# EAGLE design Pinguino4550 (EAGLE 7.6.0)
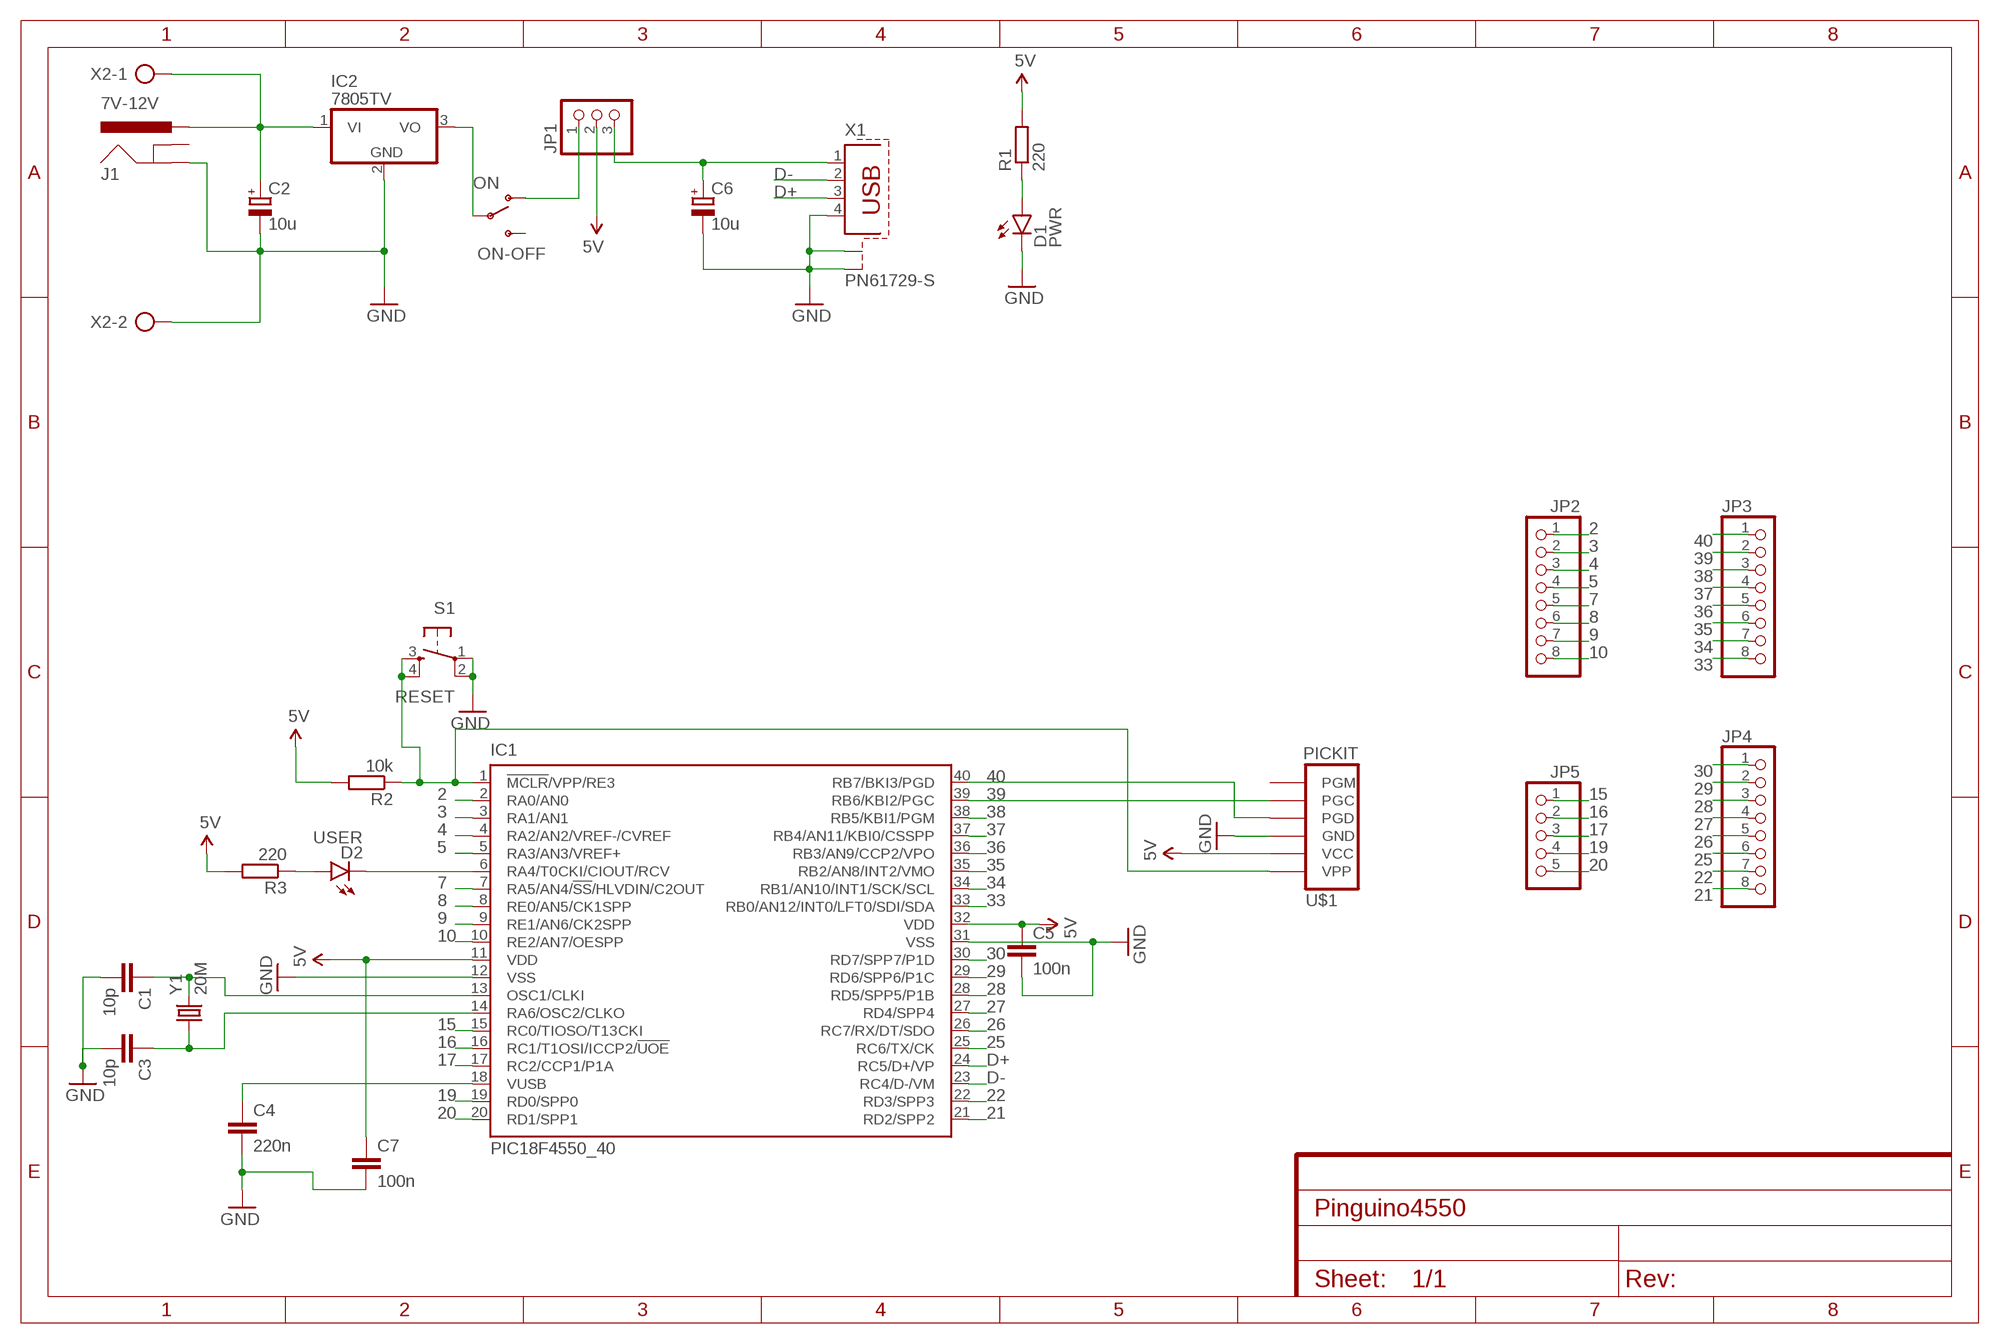
[diagram p0: schematic, sheet 1]

## Parts
C1  10p  C-EU025-030X050  [C025-030X050]
C2  10u  CPOL-EUE2.5-5  [E2,5-5]
C3  10p  C-EU025-030X050  [C025-030X050]
C4  220n  C-EU025-030X050  [C025-030X050]
C5  100n  C-EU025-030X050  [C025-030X050]
C6  10u  CPOL-EUE2.5-5  [E2,5-5]
C7  100n  C-EU025-030X050  [C025-030X050]
D1  PWR  LED5MM  [LED5MM]
D2  USER  LED5MM  [LED5MM]
IC1  PIC18F4550_40  [DIL40]
IC2  7805TV  [TO220V]
J1  7V-12V  POWER_JACKSLT  [POWER_JACK_SLOT]
JP1  PINHD-1X3  [1X03]
JP2  PINHD-1X8  [1X08]
JP3  PINHD-1X8  [1X08]
JP4  PINHD-1X8  [1X08]
JP5  PINHD-1X5  [1X05]
ON-OFF  ON  SWITCH-SPDTPTH  [SWITCH-SPDT]
R1  220  R-EU_0207/7  [0207/7]
R2  10k  R-EU_0207/7  [0207/7]
R3  220  R-EU_0207/7  [0207/7]
S1  RESET  TAC_SWITCHPTH  [TACTILE-PTH]
U$1  PICKIT  PIC-ICSPPOLAR_LOCK  [MOLEX-1X6_LOCK]
X1  PN61729-S  [PN61729-S]
X2  AK500/2  [AK500/2]
Y1  20M  CRYSTALHC49US  [HC49US]

## Nets
2: IC1.2(RA0/AN0) JP2.1
3: IC1.3(RA1/AN1) JP2.2
4: IC1.4(RA2/AN2/VREF-/CVREF) JP2.3
5: IC1.5(RA3/AN3/VREF+) JP2.4
5V: C5.1 C7.1 IC1.11(VDD) IC1.32(VDD) JP1.2 R1.2 R2.2 R3.2 U$1.5(VCC)
7: IC1.7(RA5/AN4/!SS!/HLVDIN/C2OUT) JP2.5
8: IC1.8(RE0/AN5/CK1SPP) JP2.6
9: IC1.9(RE1/AN6/CK2SPP) JP2.7
10: IC1.10(RE2/AN7/OESPP) JP2.8
15: IC1.15(RC0/TIOSO/T13CKI) JP5.1
16: IC1.16(RC1/T1OSI/ICCP2/!UOE) JP5.2
17: IC1.17(RC2/CCP1/P1A) JP5.3
19: IC1.19(RD0/SPP0) JP5.4
20: IC1.20(RD1/SPP1) JP5.5
21: IC1.21(RD2/SPP2) JP4.8
22: IC1.22(RD3/SPP3) JP4.7
25: IC1.25(RC6/TX/CK) JP4.6
26: IC1.26(RC7/RX/DT/SDO) JP4.5
27: IC1.27(RD4/SPP4) JP4.4
28: IC1.28(RD5/SPP5/P1B) JP4.3
29: IC1.29(RD6/SPP6/P1C) JP4.2
30: IC1.30(RD7/SPP7/P1D) JP4.1
33: IC1.33(RB0/AN12/INT0/LFT0/SDI/SDA) JP3.8
34: IC1.34(RB1/AN10/INT1/SCK/SCL) JP3.7
35: IC1.35(RB2/AN8/INT2/VMO) JP3.6
36: IC1.36(RB3/AN9/CCP2/VPO) JP3.5
37: IC1.37(RB4/AN11/KBI0/CSSPP) JP3.4
38: IC1.38(RB5/KBI1/PGM) JP3.3
39: IC1.39(RB6/KBI2/PGC) JP3.2 U$1.2(PGC)
40: IC1.40(RB7/BKI3/PGD) JP3.1 U$1.3(PGD)
D+: IC1.24(RC5/D+/VP) X1.3
D-: IC1.23(RC4/D-/VM) X1.2
GND: C1.2 C2.- C3.2 C4.2 C5.2 C6.- C7.2 D1.K(C) IC1.12(VSS) IC1.31(VSS) IC2.2(GND) J1.GND@2(GND) S1.1 S1.2 U$1.4(GND) X1.4 X1.S1 X1.S2 X2.2
N$1: C2.+ IC2.1(VI) J1.PWR X2.1
N$2: D1.A R1.1
N$3: IC2.3(VO) ON-OFF.2(P)
N$4: JP1.1 ON-OFF.1(O)
N$5: C1.1 IC1.13(OSC1/CLKI) Y1.2
N$6: C6.+ JP1.3 X1.1
N$7: C3.1 IC1.14(RA6/OSC2/CLKO) Y1.1
N$8: IC1.1(!MCLR!/VPP/RE3) R2.1 S1.3 S1.4 U$1.6(VPP)
N$11: D2.K(C) IC1.6(RA4/T0CKI/CIOUT/RCV)
N$12: D2.A R3.1
N$13: C4.1 IC1.18(VUSB)
Unconnected: J1.GND@1(GNDBREAK) ON-OFF.3(S) U$1.1(PGM)

## Library data of the parts
C1 C3-C5 C7 = rcl:C-EU: CAPACITOR, European symbol
C2 C6 = rcl:CPOL-EU: POLARIZED CAPACITOR, European symbol
D1 D2 = SparkFun-LED:LED: LEDs Standard schematic elements and footprints for 5mm, 3mm, 1206, and 0603 sized LEDs. 5mm - Spark Fun Electronics SKU : COM-00529 (and others)
IC1 = microchip:PIC18F4*_40: USB Microcontrollers with nanoWatt Technology High-Performance, Enhanced Flash, 28/40/44-Pin, Source: http://ww1.microchip.com/downloads/en/devicedoc/39632c.pdf; MF: MICROCHIP; MPN: PIC18F4550-I/P; OC_FARNELL: 9321357; OC_NEWARK: 74K8623
IC2 = linear:78*: Positive VOLTAGE REGULATOR Source: http://cache.national.com/ds/LM/LM78L05.pdf http://www.fairchildsemi.com/ds/LM/LM7805.pdf
J1 = SparkFun-Connectors:POWER_JACK: Power Jack This is the standard 5.5mm barrel jack for power. The PTH is the most common, proven, reliable, footprint. The Slot footprint only works if the mill layer is transmitted to the PCB fab house so be warned. Mating wall wart : TOL-00298 (and others); PROD_ID: PRT-00119
JP1 = pinhead:PINHD-1X3: PIN HEADER
JP2-JP4 = pinhead:PINHD-1X8: PIN HEADER
JP5 = pinhead:PINHD-1X5: PIN HEADER
ON-OFF = SparkFun-Electromechanical:SWITCH-SPDT: SPDT Switch Simple slide switch, Spark Fun Electronics SKU : COM-00102 DPDT SMT slide switch, AYZ0202, SWCH-08179; PROD_ID: SWCH-08261
R1-R3 = rcl:R-EU_: RESISTOR, European symbol
S1 = SparkFun-Retired:TAC_SWITCH: Momentary Switch Button commonly used for reset or general input. Spark Fun Electronics SKU : COM-00097 SMT- SWCH-08247
U$1 = SparkFun-Connectors:PIC-ICSP: ISCP Programming connector for UAV, UBW Kit, etc.
X1 = con-berg:PN61729-S: BERG USB connector; OC_FARNELL: unknown; OC_NEWARK: unknown
X2 = con-ptr500:AK500/2: CONNECTOR; OC_FARNELL: unknown; OC_NEWARK: unknown
Y1 = SparkFun-FreqCtrl:CRYSTAL: Various standard crystals. Proven footprints.

## Board
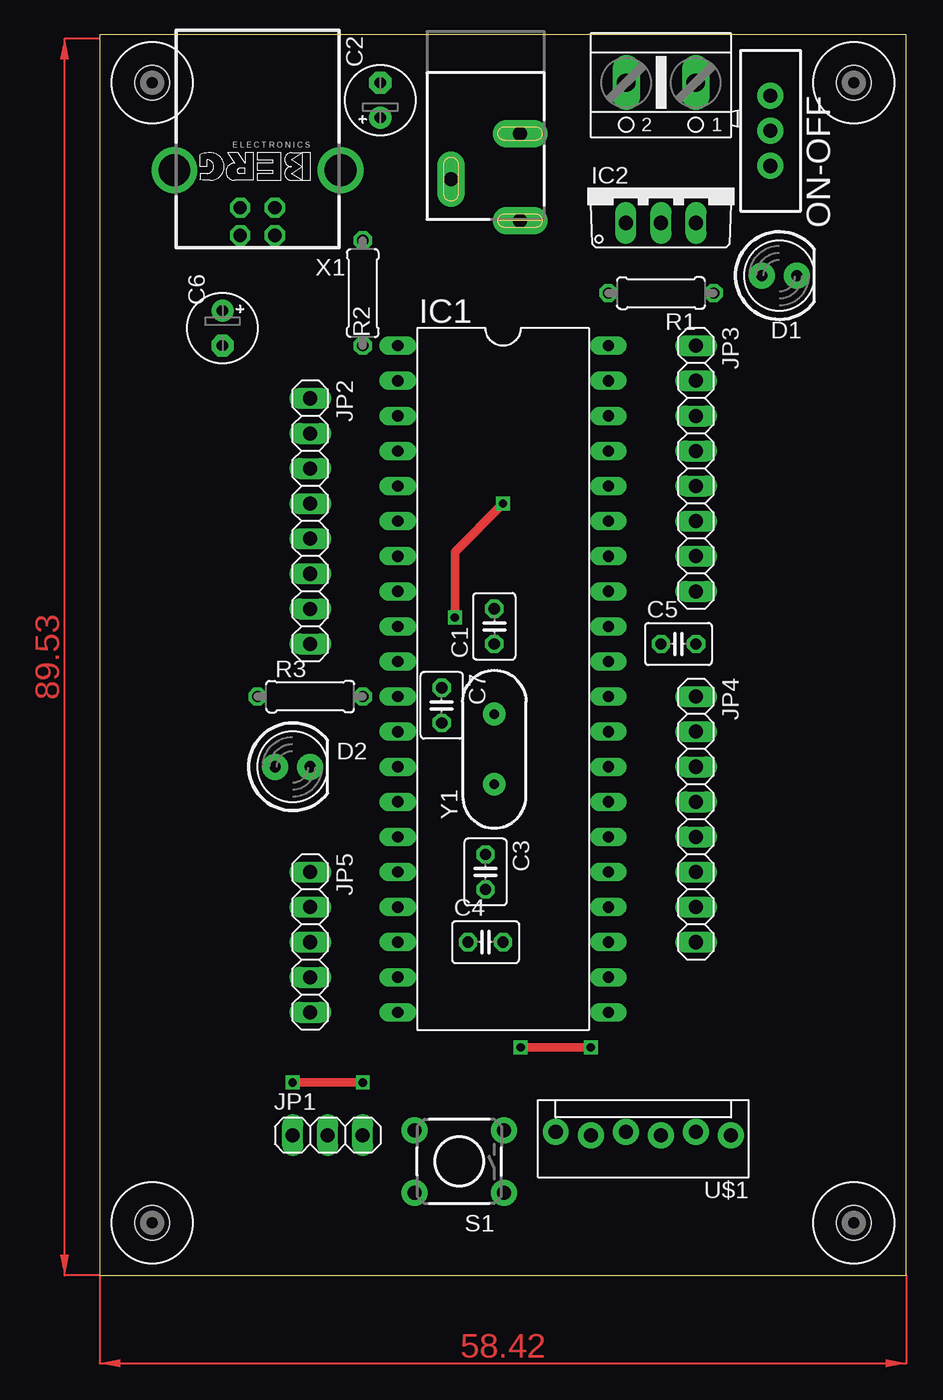
[diagram p1: board, top side]
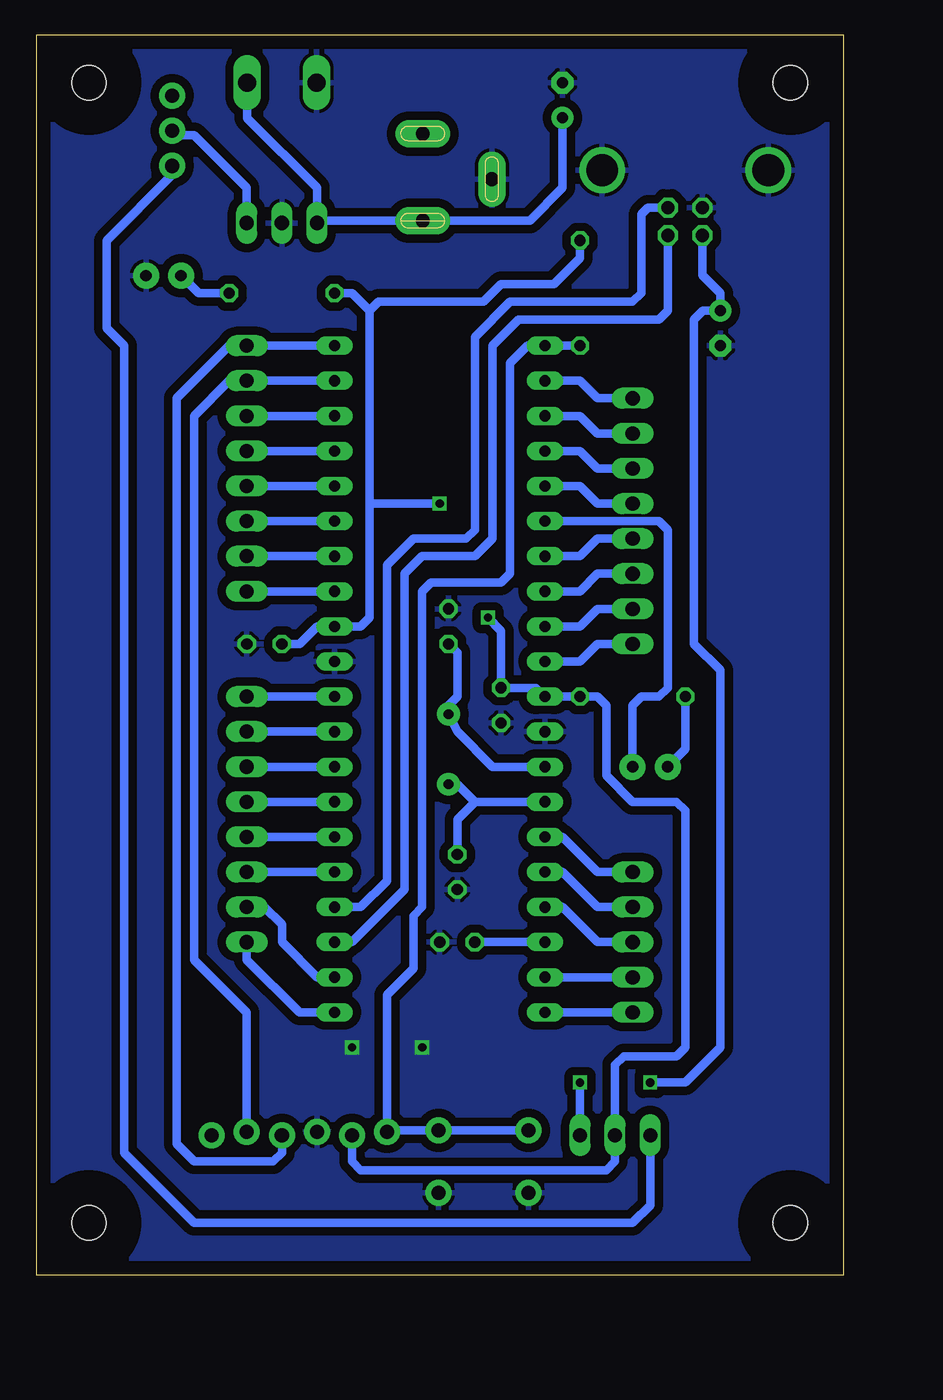
[diagram p2: board, bottom side, seen from below]

Size 58.4 x 89.84 mm. Coordinates in mm from the lower left corner, seen from the top.
Outline: 0,0 58.4,0 58.4,89.84 0,89.84 0,0
Copper layers (1*16): Top 0.035mm / dielectric 1.5mm / Bottom 0.035mm
Design rules "default": minimum track width 10mil, minimum drill 24mil, track to track 8mil, track to pad 8mil, pad to pad 8mil, via to via 8mil, smd to smd 8mil, copper to edge 40mil, drill to drill 8mil, minimum pad ring 10mil, minimum via ring 8mil, stop-mask expansion 4mil, vias tented up to drill 0mil, thermal gap 10mil

### Footprints (pad centres in the part's own frame; a part is rotated, then mirrored left to right if it is on the bottom)
C025-030X050 = drill 0.813 octagon: 1 -1.27,0; 2 1.27,0
E2,5-5 = drill 0.813 pad 1.6: + -1.27,0 | drill 0.813 pad 1.6 octagon: - 1.27,0
LED5MM = drill 0.813 pad 1.88: A -1.27,0; K 1.27,0
DIL40 = drill 0.813 long: 1 -24.13,-7.62; 2 -21.59,-7.62; 3 -19.05,-7.62; 4 -16.51,-7.62; 5 -13.97,-7.62; 6 -11.43,-7.62; 7 -8.89,-7.62; 8 -6.35,-7.62; 9 -3.81,-7.62; 10 -1.27,-7.62; 11 1.27,-7.62; 12 3.81,-7.62; 13 6.35,-7.62; 14 8.89,-7.62; 15 11.43,-7.62; 16 13.97,-7.62; 17 16.51,-7.62; 18 19.05,-7.62; 19 21.59,-7.62; 20 24.13,-7.62; 21 24.13,7.62; 22 21.59,7.62; 23 19.05,7.62; 24 16.51,7.62; 25 13.97,7.62; 26 11.43,7.62; 27 8.89,7.62; 28 6.35,7.62; 29 3.81,7.62; 30 1.27,7.62; 31 -1.27,7.62; 32 -3.81,7.62; 33 -6.35,7.62; 34 -8.89,7.62; 35 -11.43,7.62; 36 -13.97,7.62; 37 -16.51,7.62; 38 -19.05,7.62; 39 -21.59,7.62; 40 -24.13,7.62
TO220V = drill 1.016 long: 1 -2.54,-2.54; 2 0,-2.54; 3 2.54,-2.54
POWER_JACK_SLOT = drill 1 pad 2 long: GND@1 2.58,7.5; GND@2 7.58,10.8; PWR 2.58,13.8
1X03 = drill 1.016 long: 1 -2.54,0; 2 0,0; 3 2.54,0
1X08 = drill 1.016 long: 1 -8.89,0; 2 -6.35,0; 3 -3.81,0; 4 -1.27,0; 5 1.27,0; 6 3.81,0; 7 6.35,0; 8 8.89,0
1X05 = drill 1.016 long: 1 -5.08,0; 2 -2.54,0; 3 0,0; 4 2.54,0; 5 5.08,0
SWITCH-SPDT = drill 1.016 pad 1.88: 1 0,2.54; 2 0,0; 3 0,-2.54
0207/7 = drill 0.813 octagon: 1 -3.81,0; 2 3.81,0
TACTILE-PTH = drill 1.016 pad 1.88: 1 -3.251,2.261; 2 3.251,2.261; 3 -3.251,-2.261; 4 3.251,-2.261
MOLEX-1X6_LOCK = drill 1.016 pad 1.88: 1 0,0; 2 2.54,-0.254; 3 5.08,0; 4 7.62,-0.254; 5 10.16,0; 6 12.7,-0.254
DRIL-2,5 = hole 2.5: 0,0
PN61729-S = drill 0.95 octagon: 1 1.25,4.71; 2 -1.25,4.71; 3 -1.25,2.71; 4 1.25,2.71 | drill 2.3 pad 2.9: S1 -6.02,0; S2 6.02,0
AK500/2 = drill 1.321 long: 1 -2.515,0; 2 2.515,0
HC49US = drill 0.7 pad 1.651: 1 -2.54,0; 2 2.54,0

### Placement (x,y rotation side)
C1  28.57,46.99 90 top
C2  20.32,85.09 90 top
C3  27.94,29.21 270 top
C4  27.94,24.13 0 top
C5  41.91,45.72 0 top
C6  8.89,68.58 270 top
C7  24.77,41.27 270 top
D1  49.21,72.39 0 top
D2  13.97,36.83 0 top
IC1  29.21,43.18 270 top
IC2  40.64,78.74 0 top
J1  33.02,90.17 180 top
JP1  16.51,10.16 0 top
JP2  15.24,54.61 270 top
JP3  43.18,58.42 270 top
JP4  43.18,33.02 270 top
JP5  15.24,24.13 270 top
ON-OFF  48.58,82.87 180 top
R1  40.64,71.12 180 top
R2  19.05,71.12 90 top
R3  15.24,41.91 0 top
S1  26.04,8.26 180 top
U$1  45.72,10.16 180 top
U$2  [DRIL-2,5]  3.81,3.81 0 top
U$4  [DRIL-2,5]  3.81,86.36 0 top
U$5  [DRIL-2,5]  54.61,86.36 0 top
U$6  [DRIL-2,5]  54.61,3.81 0 top
X1  11.43,80.01 180 top
X2  40.64,86.36 180 top
Y1  28.57,38.1 90 top

### Tracks (layer width: path | path; a pad name or v marks a point on that pad's centre or on a via)
2
  Bottom 0.61: JP2.1 17.78,63.5 19.05,64.77 IC1.2
3
  Bottom 0.61: JP2.2 17.78,60.96 19.05,62.23 IC1.3
4
  Bottom 0.61: JP2.3 17.78,58.42 19.05,59.69 IC1.4
5
  Bottom 0.61: IC1.5 19.05,57.15 17.78,55.88 JP2.4
5V  (via drill 0.6)
  Top 0.61: v25.72,47.62 25.72,52.39 v29.21,55.88
  Bottom 0.61: C5.1 39.37,45.72 38.1,46.99 IC1.32 34.92,46.99 34.29,47.62 34.29,55.88 | U$1.5 35.56,8.26 34.92,7.62 17.14,7.62 16.51,8.26 JP1.2 16.51,15.24 15.88,15.88 12.06,15.88 11.43,16.51 11.43,33.66 12.06,34.29 15.24,34.29 17.14,36.2 17.14,41.27 17.78,41.91 R3.2 IC1.11 22.23,42.55 C7.1 24.77,46.67 v25.72,47.62 | R1.2 35.56,71.12 34.29,69.85 | 34.29,69.85 34.29,55.88 | 34.29,69.85 33.66,70.48 26.04,70.48 24.77,71.75 20.95,71.75 19.05,73.66 R2.2 | v29.21,55.88 34.29,55.88
7
  Bottom 0.61: IC1.7 19.05,52.07 17.78,53.34 JP2.5
8
  Bottom 0.61: IC1.8 19.05,49.53 17.78,50.8 JP2.6
9
  Bottom 0.61: IC1.9 19.05,46.99 17.78,48.26 JP2.7
10
  Bottom 0.61: IC1.10 19.05,44.45 17.78,45.72 JP2.8
15
  Bottom 0.61: IC1.15 20.32,31.75 17.78,29.21 JP5.1
16
  Bottom 0.61: IC1.16 20.32,29.21 17.78,26.67 JP5.2
17
  Bottom 0.61: IC1.17 20.32,26.67 17.78,24.13 JP5.3
19
  Bottom 0.61: IC1.19 JP5.4
20
  Bottom 0.61: IC1.20 JP5.5
21
  Bottom 0.61: IC1.21 39.37,19.05 43.18,22.86 JP4.8
22
  Bottom 0.61: IC1.22 38.1,21.59 40.64,24.13 40.64,25.4 41.91,26.67 JP4.7
25
  Bottom 0.61: IC1.25 JP4.6
26
  Bottom 0.61: IC1.26 JP4.5
27
  Bottom 0.61: IC1.27 JP4.4
28
  Bottom 0.61: IC1.28 JP4.3
29
  Bottom 0.61: IC1.29 JP4.2
30
  Bottom 0.61: IC1.30 JP4.1
33
  Bottom 0.61: JP3.8 IC1.33
34
  Bottom 0.61: JP3.7 IC1.34
35
  Bottom 0.61: JP3.6 IC1.35
36
  Bottom 0.61: IC1.36 JP3.5
37
  Bottom 0.61: JP3.4 IC1.37
38
  Bottom 0.61: JP3.3 IC1.38
39
  Bottom 0.61: IC1.39 JP3.2 44.45,64.77 46.99,62.23 46.99,22.86 43.18,19.05 U$1.2
40
  Bottom 0.61: IC1.40 JP3.1 44.45,67.31 48.26,63.5 48.26,9.53 46.99,8.26 41.27,8.26 40.64,8.89 U$1.3
D+
  Bottom 0.61: X1.3 14.14,77.3 14.61,76.83 14.61,71.12 15.24,70.48 24.13,70.48 26.67,67.94 26.67,53.98 27.3,53.34 31.11,53.34 33.02,51.44 33.02,28.57 34.92,26.67 IC1.24
D-
  Bottom 0.61: IC1.23 35.56,24.13 31.75,27.94 31.75,50.8 30.48,52.07 26.67,52.07 25.4,53.34 25.4,67.31 23.5,69.22 13.34,69.22 12.7,69.85 12.7,75.28 X1.2
GND  (via drill 0.6)
  Top 0.61: v35.56,16.51 v30.48,16.51
  pour Bottom (isolate 0.61): 0,0 160.02,0 167.64,99.06 0,105.41
N$1
  Bottom 0.61: X2.1 43.16,83.8 38.1,78.74 IC2.1 37.93,76.37 J1.PWR 22.69,76.37 20.32,78.74 C2.+
N$2
  Bottom 0.61: R1.1 46.67,71.12 D1.A
N$3
  Bottom 0.61: IC2.3 43.18,78.74 46.99,82.55 48.26,82.55 ON-OFF.2
N$4
  Bottom 0.61: JP1.1 13.97,5.08 15.24,3.81 46.99,3.81 52.07,8.89 52.07,67.31 53.34,68.58 53.34,74.93 48.58,79.69 ON-OFF.1
N$5
  Bottom 0.61: IC1.13 25.4,36.83 27.94,39.37 Y1.2 28.57,41.27 27.94,41.91 27.94,45.09 C1.1
N$6  (via drill 0.6)
  Top 0.61: v19.05,13.97 v13.97,13.97
  Bottom 0.61: X1.1 10.18,72.41 8.89,71.12 C6.+ 10.16,69.85 10.79,69.22 10.79,45.72 8.89,43.81 8.89,16.51 11.43,13.97 v13.97,13.97 | JP1.3 v19.05,13.97
N$7
  Bottom 0.61: IC1.14 26.67,34.29 | C3.1 27.94,33.02 26.67,34.29 | Y1.1 27.94,35.56 26.67,34.29
N$8
  Bottom 0.61: S1.4 S1.3 32.92,10.52 U$1.6 33.02,20.32 31.11,22.23 31.11,26.04 30.48,26.67 30.48,49.53 29.84,50.16 24.77,50.16 24.13,50.8 24.13,66.04 22.86,67.31 IC1.1 R2.1
N$11
  Bottom 0.61: IC1.6 13.34,54.61 12.7,53.98 12.7,42.55 13.34,41.91 14.61,41.91 15.24,41.27 D2.K
N$12
  Bottom 0.61: R3.1 11.43,38.1 D2.A
N$13
  Bottom 0.61: C4.1 IC1.18
(copper drawn outside any net)
  shapes: Top area x2

### Text on the board
tDocu: 7 / 6 / 5 / 4 / 3 / 2 / 1/SCL/SCK / 0/SDA/SDI | A0/13 / A1/14 / A2/15 / A3/16 / A4/17 / A5/18 / A6/19 / A7/20 | 28 / 27 / 26 / 25 / 9/RX/SD0 / 8/TX / 24 / 23 | 10 / PWM/11 / PWM/12 / 21 / 22 | RESET | EXT-USB | VPP / VDD / VSS / PGD / PGC
200bmp: C:/Users/Jose/AMD Servicios/Utils/AMD-Servicios.bmp | PINGUINO / 4550